# Altium project MODULIQ_ADC_40M_20B_2CH.PrjPcb (part 2 of 2)

## Sheet Power_Supply.SchDoc: Power Supply
size A3; Author: M.Beldyga; CompanyName: WUT ISE; DrawnBy: M.Beldyga; Organization: WUT ISE; Address1: PW ISE; Address2: Nowowiejska 15/19 00-665 Warsaw; Address3: micbeldyga@gmail.com; SheetNumber: 4; SheetTotal: 4; ModifiedBy: -; CheckedDate: -; Title2: MODULIQ; DivGrp: WUT ISE; Designer: M.Beldyga; ModifiedDate: -; ProjectName: Sensor Box
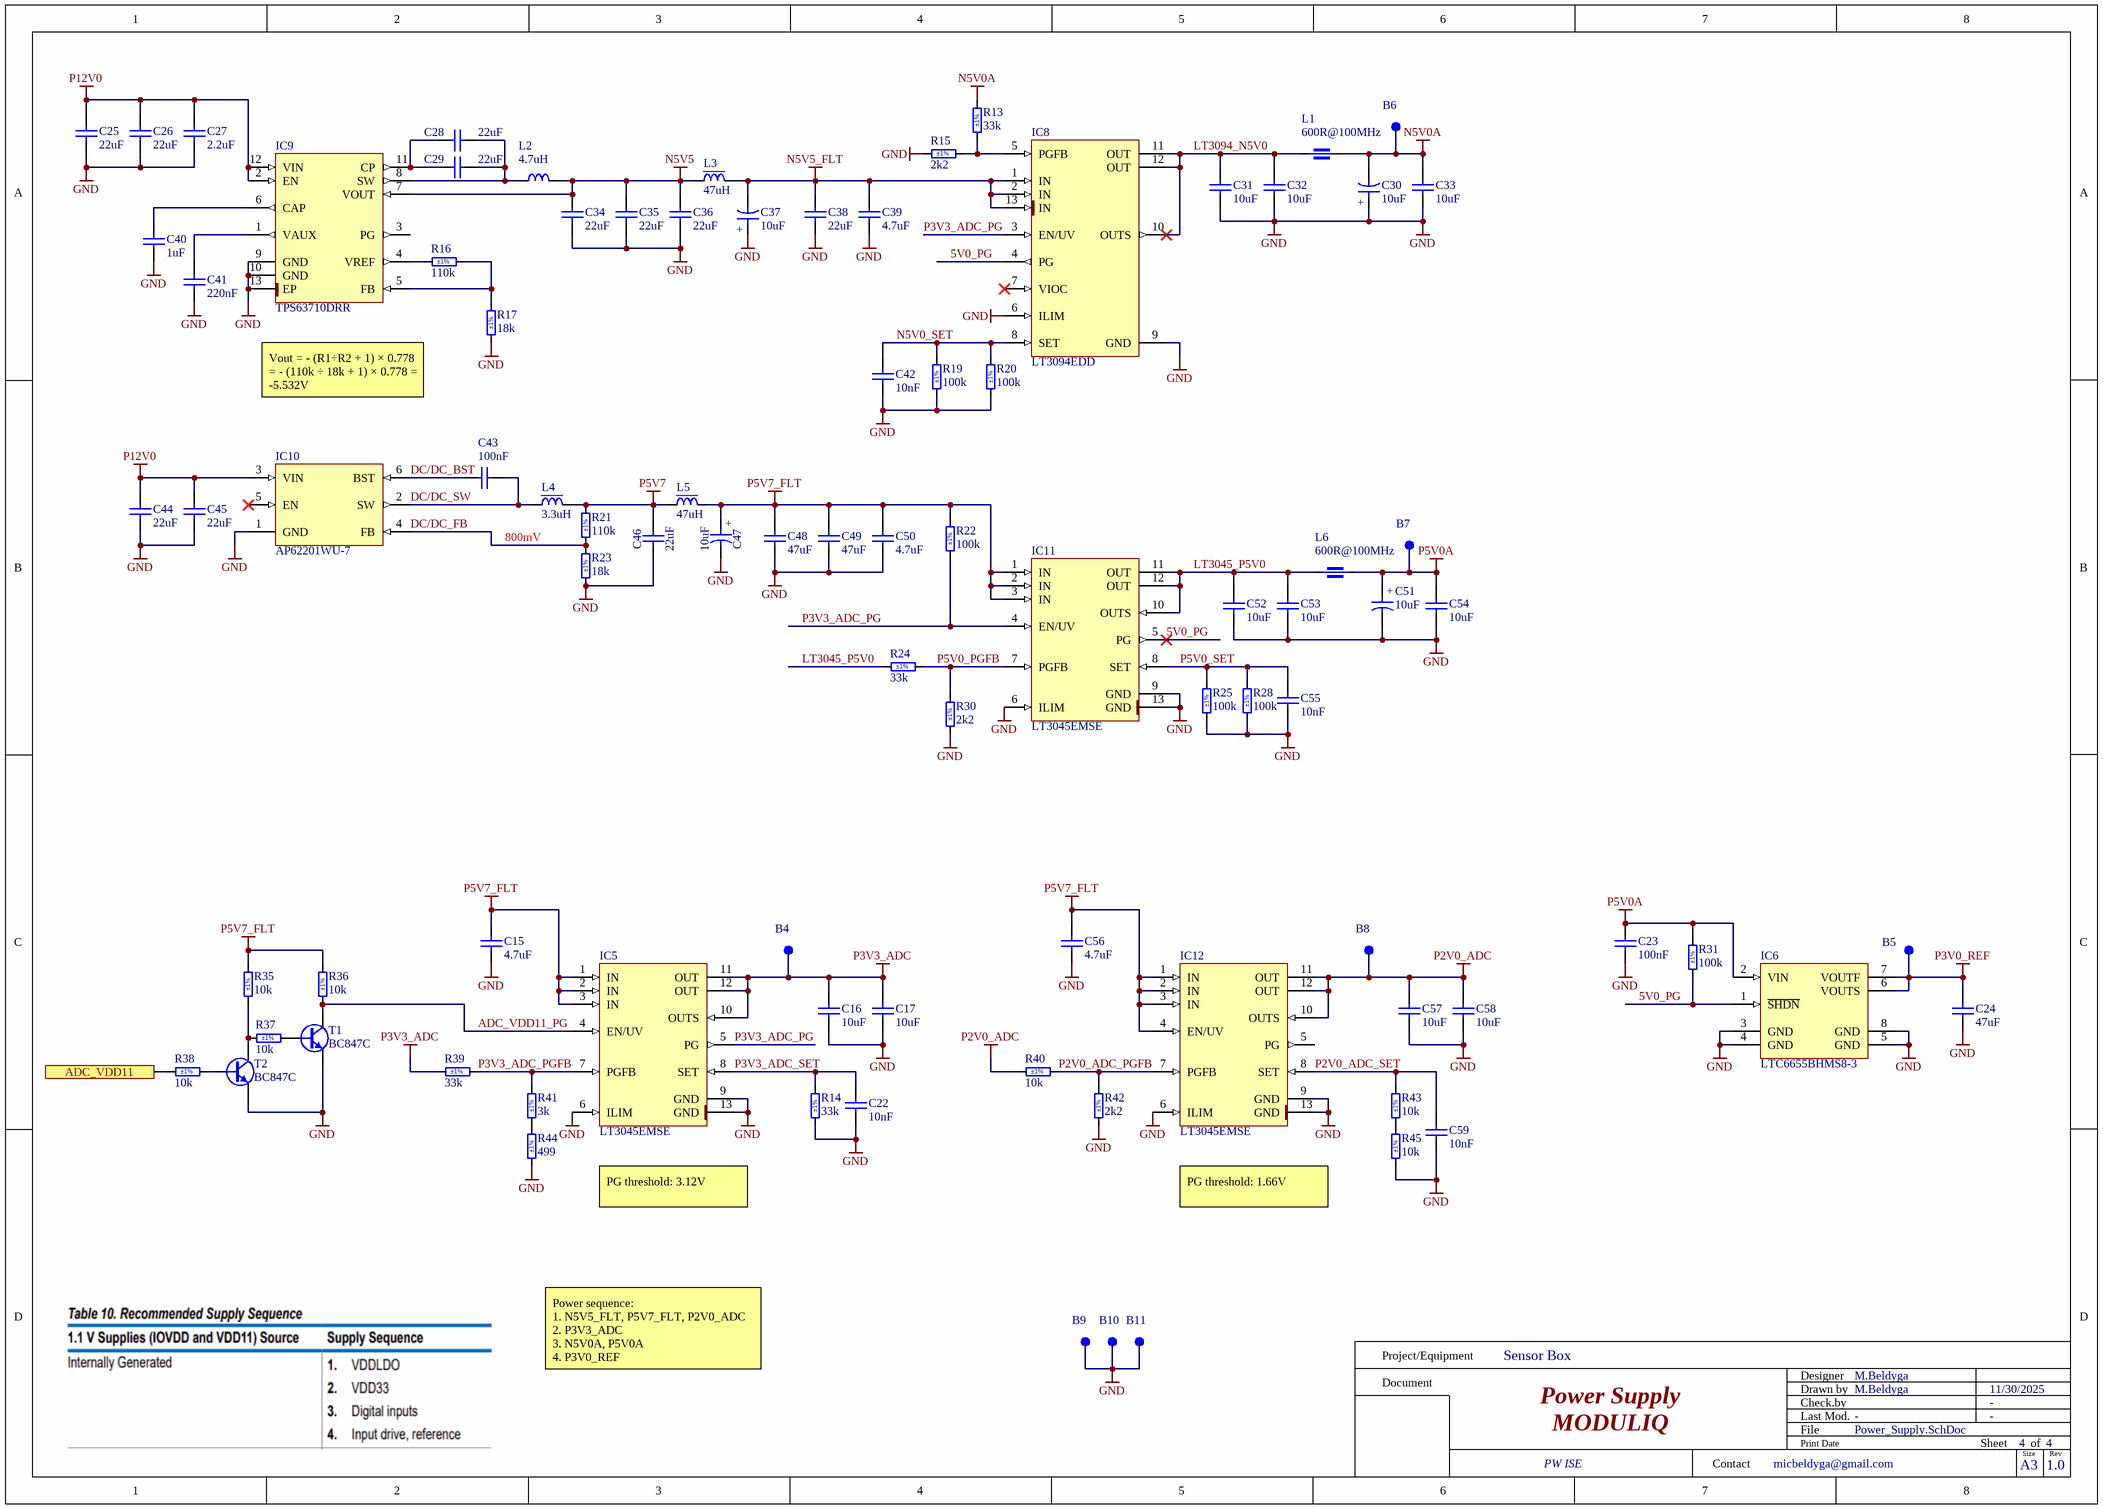
[diagram p3: Power_Supply.SchDoc]

### Parts
B4  SMD Pad  [C100]  (value not drawn)  (no BOM)
B5  SMD Pad  [C100]  (value not drawn)  (no BOM)
B6  SMD Pad  [C100]  (value not drawn)  (no BOM)
B7  SMD Pad  [C100]  (value not drawn)  (no BOM)
B8  SMD Pad  [C100]  (value not drawn)  (no BOM)
B9  SMD Pad  [C100]  (value not drawn)  (no BOM)
B10  SMD Pad  [C100]  (value not drawn)  (no BOM)
B11  SMD Pad  [C100]  (value not drawn)  (no BOM)
C15  4.7uF  [CAPC1608X90N]
C16  10uF  [CAPC2012X95N]
C17  10uF  [CAPC2012X95N]
C22  10nF  [CAPC1005X55N]
C23  100nF  [CAPC1005X55N]
C24  47uF  [CAPC2012X140N]
C25  22uF  [CAPC2012X135N]
C26  22uF  [CAPC2012X135N]
C27  2.2uF  [CAPC1005X55N]
C28  22uF  [CAPC2012X135N]
C29  22uF  [CAPC2012X135N]
C30  10uF  [CAPMP3216X180N]
C31  10uF  [CAPC2012X95N]
C32  10uF  [CAPC2012X95N]
C33  10uF  [CAPC2012X95N]
C34  22uF  [CAPC2012X135N]
C35  22uF  [CAPC2012X135N]
C36  22uF  [CAPC2012X135N]
C37  10uF  [CAPMP3216X180N]
C38  22uF  [CAPC2012X135N]
C39  4.7uF  [CAPC1608X90N]
C40  1uF  [CAPC1005X55N]
C41  220nF  [CAPC1005X55N]
C42  10nF  [CAPC1005X55N]
C43  100nF  [CAPC1005X55N]
C44  22uF  [CAPC2012X135N]
C45  22uF  [CAPC2012X135N]
C46  22uF  [CAPC2012X135N]
C47  10uF  [CAPMP3216X180N]
C48  47uF  [CAPC3216X180N]
C49  47uF  [CAPC3216X180N]
C50  4.7uF  [CAPC1608X90N]
C51  10uF  [CAPMP3216X180N]
C52  10uF  [CAPC2012X95N]
C53  10uF  [CAPC2012X95N]
C54  10uF  [CAPC2012X95N]
C55  10nF  [CAPC1005X55N]
C56  4.7uF  [CAPC1608X90N]
C57  10uF  [CAPC2012X95N]
C58  10uF  [CAPC2012X95N]
C59  10nF  [CAPC1005X55N]
IC5  LT3045EMSE  [SOP65P490X110-13N-R175X294]
IC6  LTC6655BHMS8-3  [SOP65P490X110-8N]
IC8  LT3094EDD  [SON45P300X300X80-13N-R175X248]
IC9  TPS63710DRR  [SON50P300X300X80-13N-R160X260]
IC10  AP62201WU-7  [SOT95P280X100-6N]
IC11  LT3045EMSE  [SOP65P490X110-13N-R175X294]
IC12  LT3045EMSE  [SOP65P490X110-13N-R175X294]
L1  600R@100MHz  [INDC1608X95N]
L2  4.7uH  [IND_COILCRAFT_EPL3015]
L3  47uH  [IND_WURTH_WE-LHMI_7050]
L4  3.3uH  [IND_COILCRAFT_SD43]
L5  47uH  [IND_WURTH_WE-LHMI_7050]
L6  600R@100MHz  [INDC1608X95N]
R13  33k  Tolerance: ±1%  [RESC1005X40N]
R14  33k  Tolerance: ±1%  [RESC1005X40N]
R15  2k2  Tolerance: ±1%  [RESC1005X40N]
R16  110k  Tolerance: ±1%  [RESC1005X40N]
R17  18k  Tolerance: ±1%  [RESC1005X40N]
R19  100k  Tolerance: ±1%  [RESC1005X40N]
R20  100k  Tolerance: ±1%  [RESC1005X40N]
R21  110k  Tolerance: ±1%  [RESC1005X40N]
R22  100k  Tolerance: ±1%  [RESC1005X40N]
R23  18k  Tolerance: ±1%  [RESC1005X40N]
R24  33k  Tolerance: ±1%  [RESC1005X40N]
R25  100k  Tolerance: ±1%  [RESC1005X40N]
R28  100k  Tolerance: ±1%  [RESC1005X40N]
R30  2k2  Tolerance: ±1%  [RESC1005X40N]
R31  100k  Tolerance: ±1%  [RESC1005X40N]
R35  10k  Tolerance: ±1%  [RESC1005X40N]
R36  10k  Tolerance: ±1%  [RESC1005X40N]
R37  10k  Tolerance: ±1%  [RESC1005X40N]
R38  10k  Tolerance: ±1%  [RESC1005X40N]
R39  33k  Tolerance: ±1%  [RESC1005X40N]
R40  10k  Tolerance: ±1%  [RESC1005X40N]
R41  3k  Tolerance: ±1%  [RESC1005X40N]
R42  2k2  Tolerance: ±1%  [RESC1005X40N]
R43  10k  Tolerance: ±1%  [RESC1005X40N]
R44  499  Tolerance: ±1%  [RESC1005X40N]
R45  10k  Tolerance: ±1%  [RESC1005X40N]
T1  BC847C  [SOT95P240X110-3N]
T2  BC847C  [SOT95P240X110-3N]

### Ports
ADC_VDD11

### Nets
GND: B9.1 B10.1 B11.1 C15.1 C16.1 C17.1 C22.1 C23.1 C24.1 C25.1 C26.1 C27.1 C30.1 C31.1 C32.1 C33.1 C34.1 C35.1 C36.1 C37.1 C38.1 C39.1 C40.1 C41.1 C42.1 C44.1 C45.1 C46.1 C47.2 C48.1 C49.1 C50.1 C51.2 C52.1 C53.1 C54.1 C55.1 C56.1 C57.1 C58.1 C59.1 IC5.6(ILIM) IC5.9(GND) IC5.13(GND) IC6.3(GND) IC6.4(GND) IC6.5(GND) IC6.8(GND) IC8.6(ILIM) IC8.9(GND) IC9.9(GND) IC9.10(GND) IC9.13(EP) IC10.1(GND) IC11.6(ILIM) IC11.9(GND) IC11.13(GND) IC12.6(ILIM) IC12.9(GND) IC12.13(GND) R14.1 R15.2 R17.1 R19.1 R20.1 R23.1 R25.1 R28.1 R30.1 R42.2 R44.1 R45.1 T1.2(E) T2.2(E)
N5V0A: B6.1 C30.2 C33.2 L1.2 R13.2
N5V5: C34.2 C35.2 C36.2 IC9.7(VOUT) L2.2 L3.1
N5V5_FLT: C37.2 C38.2 C39.2 IC8.1(IN) IC8.2(IN) IC8.13(IN) L3.2
P2V0_ADC: B8.1 C57.2 C58.2 IC12.10(OUTS) IC12.11(OUT) IC12.12(OUT) R40.2
P3V0_REF: B5.1 C24.2 IC6.6(VOUTS) IC6.7(VOUTF)
P3V3_ADC: B4.1 C16.2 C17.2 IC5.10(OUTS) IC5.11(OUT) IC5.12(OUT) R39.2
P5V0A: B7.1 C23.2 C51.1 C54.2 IC6.2(VIN) L6.2 R31.2
P5V7: C46.2 L4.2 L5.1 R21.2
P5V7_FLT: C15.2 C47.1 C48.2 C49.2 C50.2 C56.2 IC5.1(IN) IC5.2(IN) IC5.3(IN) IC11.1(IN) IC11.2(IN) IC11.3(IN) IC12.1(IN) IC12.2(IN) IC12.3(IN) IC12.4(EN/UV) L5.2 R22.2 R35.1 R36.1
P12V0: C25.2 C26.2 C27.2 C44.2 C45.2 IC9.2(EN) IC9.12(VIN) IC10.3(VIN)
5V0_PG: IC6.1(~{SHDN}) IC8.4(PG) IC11.5(PG) R31.1
ADC_VDD11_PG: IC5.4(EN/UV) R36.2 T1.3(C)
DC/DC_BST: C43.1 IC10.6(BST)
DC/DC_FB: IC10.4(FB) R21.1 R23.2
DC/DC_SW: C43.2 IC10.2(SW) L4.1
LT3045_P5V0: C52.2 C53.2 IC11.10(OUTS) IC11.11(OUT) IC11.12(OUT) L6.1 R24.2
LT3094_N5V0: C31.2 C32.2 IC8.10(OUTS) IC8.11(OUT) IC8.12(OUT) L1.1
N5V0_SET: C42.2 IC8.8(SET) R19.2 R20.2
P2V0_ADC_PGFB: IC12.7(PGFB) R40.1 R42.1
P2V0_ADC_SET: C59.2 IC12.8(SET) R43.2
P3V3_ADC_PG: IC5.5(PG) IC8.3(EN/UV) IC11.4(EN/UV) R22.1
P3V3_ADC_PGFB: IC5.7(PGFB) R39.1 R41.2
P3V3_ADC_SET: C22.2 IC5.8(SET) R14.2
P5V0_PGFB: IC11.7(PGFB) R24.1 R30.2
P5V0_SET: C55.2 IC11.8(SET) R25.2 R28.2
VDD11: R38.2 ; port ADC_VDD11
NetC28_1: C28.1 C29.1 IC9.8(SW) L2.1
NetC28_2: C28.2 C29.2 IC9.11(CP)
NetC40_2: C40.2 IC9.6(CAP)
NetC41_2: C41.2 IC9.1(VAUX)
NetIC8_5: IC8.5(PGFB) R13.1 R15.1
NetIC9_4: IC9.4(VREF) R16.1
NetIC9_5: IC9.5(FB) R16.2 R17.2
NetR35_2: R35.2 R37.2 T2.3(C)
NetR37_1: R37.1 T1.1(B)
NetR38_1: R38.1 T2.1(B)
NetR41_1: R41.1 R44.2
NetR43_1: R43.1 R45.2

Not connected (* = marked no-connect by the designer): IC8 7(VIOC)*; IC9 3(PG); IC10 5(EN)*; IC12 5(PG)

### Notes on the sheet
- Vout = - (R1÷R2 + 1) × 0.778 = - (110k ÷ 18k + 1) × 0.778 = -5.532V
- (near L4) 800mV
- PG threshold: 3.12V
- PG threshold: 1.66V
- Power sequence:
  1. N5V5_FLT, P5V7_FLT, P2V0_ADC
  2. P3V3_ADC
  3. N5V0A, P5V0A
  4. P3V0_REF
- Project/Equipment
- Document
- Designer
- Drawn by
- Check.by
- Contact
- File
- Last Mod.
- Print Date
- Sheet
- Size
- A3
- of
- Rev
- (in symbol CTE3216-18_10UF_10V_10%_LESR1800) +
- (in symbol CTE3216-18_10UF_16V_20%_AVX_TCJ) +

### Library data of the parts
B4-B11 = SMD_PAD_D1MM: Pad; Part Description: 1mm Diameter SMD Pad; Mounted: No; Part Number: SMD_PAD_D1MM; Component Type: Standard (No BOM); Pin Count: 1; Family: SMD Pad; Socket: No; SMD: Yes; Sense: No; Status: None; ComponentHeight: 0mm; HelpURL: Undefined; Author: CERN DEM JLC; CreateDate: 10/10/2017; LatestRevisionDate: 10/10/2017; PackageDescription: 1mm Diameter SMD Pad
C15 C39 C50 C56 = CC0603_4.7UF_25V_10%_X5R: Non-polarised capacitor; Part Description: SMD Multilayer Chip Ceramic Capacitor; Manufacturer: GENERIC; Manufacturer1 Part Number: GRM188R61E475KE11D; Voltage: 25V; TC: X5R; Tolerance: ±10%; Part Number: CC0603_4.7UF_25V_10%_X5R; Component Kind: Standard; Component Type: Standard; Pin Count: 2; Value: 4.7uF; Status: None; Manufacturer Part Number: CC0603_4.7UF_25V_10%_X5R; Case: 0603; Mounted: Yes; Socket: No; SMD: Yes; Sense: No; Manufacturer1 Example: MURATA; Manufacturer1 ComponentHeight: 0.95mm; HelpURL: \\cern.ch\dfs\Applications\Altium\Datasheets\CC0603_MURATA_GRM188R61E475KE11D.pdf; Author: CERN DEM JLC; CreateDate: 11/10/2014; LatestRevisionDate: 11/10/2014
C16 C17 C31-C33 C52-C54 C57 C58 = CC0805_10UF_25V_10%_X5R: Non-polarised capacitor; Part Description: SMD Multilayer Chip Ceramic Capacitor; Manufacturer: GENERIC; Manufacturer1 Part Number: GRM219R61E106KA12D; Voltage: 25V; TC: X5R; Tolerance: ±10%; Part Number: CC0805_10UF_25V_10%_X5R; Component Kind: Standard; Component Type: Standard; Pin Count: 2; Value: 10uF; Status: Preferred; Manufacturer Part Number: CC0805_10UF_25V_10%_X5R; Case: 0805; Mounted: Yes; Socket: No; SMD: Yes; Sense: No; Manufacturer1 Example: MURATA; Manufacturer1 ComponentHeight: 0.95mm; HelpURL: \\cern.ch\dfs\Applications\Altium\Datasheets\CC0805_X5R_MURATA_GRM.pdf; Author: CERN DEM JLC; CreateDate: 10/25/2012; LatestRevisionDate: 9/6/2016
C22 C42 C55 C59 = CC0402_10NF_16V_10%_X7R: Non-polarised capacitor; Part Description: SMD Multilayer Chip Ceramic Capacitor; Manufacturer: GENERIC; Manufacturer1 Part Number: 223878715636; Voltage: 16V; TC: X7R; Tolerance: ±10%; Part Number: CC0402_10NF_16V_10%_X7R; Component Kind: Standard; Component Type: Standard; Pin Count: 2; Value: 10nF; Status: Not Recommended; Manufacturer Part Number: CC0402_10NF_16V_10%_X7R; Case: 0402; Mounted: Yes; Socket: No; SMD: Yes; Sense: No; Manufacturer1 Example: PHYCOMP; Manufacturer1 ComponentHeight: 0.55mm; HelpURL: \\cern.ch\dfs\Applications\Altium\Datasheets\CC0402_X7R_PHYCOMP.pdf; Author: CERN DEM JLC; CreateDate: 12/3/2007; LatestRevisionDate: 12/3/2007
C23 = CC0402_100NF_50V_10%_X7R: Non-polarised capacitor; Part Description: SMD Multilayer Chip Ceramic Capacitor; Manufacturer: GENERIC; Manufacturer1 Part Number: GRM155R71H104KE14D; Voltage: 50V; TC: X7R; Tolerance: ±10%; Part Number: CC0402_100NF_50V_10%_X7R; Component Kind: Standard; Component Type: Standard; Pin Count: 2; Value: 100nF; Status: None; Manufacturer Part Number: CC0402_100NF_50V_10%_X7R; Case: 0402; Mounted: Yes; Socket: No; SMD: Yes; Sense: No; Manufacturer1 Example: MURATA; Manufacturer1 ComponentHeight: 0.55mm; HelpURL: \\cern.ch\dfs\Applications\Altium\Datasheets\CC0402_MURATA_GRM155R71H104KE14D.pdf; Author: CERN DEM MR; CreateDate: 6/30/2017; LatestRevisionDate: 6/30/2017
C24 = CC0805_47UF_6.3V_10%_X5R: Non-polarised capacitor; Part Description: SMD Multilayer Chip Ceramic Capacitor; Manufacturer: GENERIC; Manufacturer1 Part Number: C0805C476K9PAC; Voltage: 6.3V; TC: X5R; Tolerance: ±10%; Part Number: CC0805_47UF_6.3V_10%_X5R; Component Kind: Standard; Component Type: Standard; Pin Count: 2; Value: 47uF; Status: Preferred; Manufacturer Part Number: CC0805_47UF_6.3V_10%_X5R; Case: 0805; Mounted: Yes; Socket: No; SMD: Yes; Sense: No; Manufacturer1 Example: KEMET; Manufacturer1 ComponentHeight: 1.4mm; HelpURL: \\cern.ch\dfs\Applications\Altium\Datasheets\CC0805_X5R_KEMET.pdf; Author: CERN DEM HF; CreateDate: 7/10/2023; LatestRevisionDate: 7/10/2023
C25 C26 C28 C29 C34-C36 C38 C44-C46 = CC0805_22UF_16V_10%_X5R: Non-polarised capacitor; Part Description: SMD Multilayer Chip Ceramic Capacitor; Manufacturer: GENERIC; Manufacturer1 Part Number: C2012X5R1C226KT; Voltage: 16V; TC: X5R; Tolerance: ±10%; Part Number: CC0805_22UF_16V_10%_X5R; Component Kind: Standard; Component Type: Standard; Pin Count: 2; Value: 22uF; Status: Preferred; Manufacturer Part Number: CC0805_22UF_16V_10%_X5R; Case: 0805; Mounted: Yes; Socket: No; SMD: Yes; Sense: No; Manufacturer1 Example: TDK; Manufacturer1 ComponentHeight: 1.35mm; HelpURL: \\cern.ch\dfs\Applications\Altium\Datasheets\CC0805_X5R_TDK_C.pdf; Author: CERN DEM JLC
  C25 C26 C28 C29 C34-C36 C44 C45: CreateDate: 10/25/2012; LatestRevisionDate: 10/25/2012
  C38 C46: CreateDate: 25.10.2012; LatestRevisionDate: 25.10.2012
C27 = CC0402_2.2UF_25V_10%_X5R: Non-polarised capacitor; Part Description: SMD Multilayer Chip Ceramic Capacitor; Manufacturer: GENERIC; Manufacturer1 Part Number: C1005X5R1E225K050; Voltage: 25V; TC: X5R; Tolerance: ±10%; Part Number: CC0402_2.2UF_25V_10%_X5R; Component Kind: Standard; Component Type: Standard; Pin Count: 2; Value: 2.2uF; Status: None; Manufacturer Part Number: CC0402_2.2UF_25V_10%_X5R; Case: 0402; Mounted: Yes; Socket: No; SMD: Yes; Sense: No; Manufacturer1 Example: TDK; Manufacturer1 ComponentHeight: 0.65mm; HelpURL: \\cern.ch\dfs\Applications\Altium\Datasheets\CC0402_X5R_TDK_C.pdf; Author: CERN DEM BC; CreateDate: 1/10/2020; LatestRevisionDate: 1/10/2020
C30 C51 = CTE3216-18_10UF_10V_10%_LESR1800: Polarised capacitor; Part Description: Low ESR 1R8 Solid Tantalum Chip Capacitor; Manufacturer: GENERIC; Manufacturer1 Part Number: TPSA106K010R1800; Voltage: 10V; Tolerance: ±10%; Part Number: CTE3216-18_10UF_10V_10%_LESR1800; Component Kind: Standard; Component Type: Standard; Pin Count: 2; Value: 10uF; Status: Preferred; Manufacturer Part Number: CTE3216-18_10UF_10V_10%_LESR1800; Case: A; Mounted: Yes; Socket: No; SMD: Yes; Sense: No; Manufacturer1 Example: AVX; Manufacturer1 ComponentHeight: 1.8mm; HelpURL: \\cern.ch\dfs\Applications\Altium\Datasheets\CTE-LESR_AVX_TPS.pdf; Author: CERN DEM JLC; CreateDate: 5/5/2008; LatestRevisionDate: 1/20/2009
C37 C47 = CTE3216-18_10UF_16V_20%_AVX_TCJ: Polarised capacitor; Part Description: ESR 0R200 Tantalum Solid Electrolytic Chip Capacitor with Conductive Polymer Electrode; Manufacturer: AVX; Manufacturer Part Number: TCJA106M016R0200; Voltage: 16V; Tolerance: ±20%; Part Number: CTE3216-18_10UF_16V_20%_AVX_TCJ; Component Kind: Standard; Component Type: Standard; Pin Count: 2; Value: 10uF; Status: Preferred; Case: A; Mounted: Yes; Socket: No; SMD: Yes; Sense: No; ComponentHeight: 1.8mm; HelpURL: \\cern.ch\dfs\Applications\Altium\Datasheets\CTE_AVX_TCJ.pdf; Author: CERN DEM JLC; CreateDate: 29.03.2012; LatestRevisionDate: 29.03.2012
C40 = CC0402_1UF_16V_10%_X5R: Non-polarised capacitor; Part Description: SMD Multilayer Chip Ceramic Capacitor; Manufacturer: GENERIC; Manufacturer1 Part Number: C1005X5R1C105KT; Voltage: 16V; TC: X5R; Tolerance: ±10%; Part Number: CC0402_1UF_16V_10%_X5R; Component Kind: Standard; Component Type: Standard; Pin Count: 2; Value: 1uF; Status: Preferred; Manufacturer Part Number: CC0402_1UF_16V_10%_X5R; Case: 0402; Mounted: Yes; Socket: No; SMD: Yes; Sense: No; Manufacturer1 Example: TDK; Manufacturer1 ComponentHeight: 0.55mm; HelpURL: \\cern.ch\dfs\Applications\Altium\Datasheets\CC0402_X5R_TDK_C.pdf; Author: CERN DEM JLC; CreateDate: 10/25/2012; LatestRevisionDate: 10/25/2012
C41 = CC0402_220NF_25V_10%_X7R: Non-polarised capacitor; Part Description: SMD Multilayer Chip Ceramic Capacitor; Manufacturer: GENERIC; Manufacturer1 Part Number: C1005X7R1E224K050; Voltage: 25V; TC: X7R; Tolerance: ±10%; Part Number: CC0402_220NF_25V_10%_X7R; Component Kind: Standard; Component Type: Standard; Pin Count: 2; Value: 220nF; Status: Preferred; Manufacturer Part Number: CC0402_220NF_25V_10%_X7R; Case: 0402; Mounted: Yes; Socket: No; SMD: Yes; Sense: No; Manufacturer1 Example: TDK; Manufacturer1 ComponentHeight: 0.55mm; HelpURL: \\cern.ch\dfs\Applications\Altium\Datasheets\CC0402_X7R_TDK_C.pdf; Author: CERN DEM BC; CreateDate: 10/19/2020; LatestRevisionDate: 10/19/2020
C43 = CC0402_100NF_16V_10%_X7R: Non-polarised capacitor; Part Description: SMD Multilayer Chip Ceramic Capacitor; Manufacturer: GENERIC; Manufacturer1 Part Number: GRM155R71C104KA88D; Voltage: 16V; TC: X7R; Tolerance: ±10%; Part Number: CC0402_100NF_16V_10%_X7R; Component Kind: Standard; Component Type: Standard; Pin Count: 2; Value: 100nF; Status: Not Recommended; Manufacturer Part Number: CC0402_100NF_16V_10%_X7R; Case: 0402; Mounted: Yes; Socket: No; SMD: Yes; Sense: No; Manufacturer1 Example: MURATA; Manufacturer1 ComponentHeight: 0.55mm; HelpURL: \\cern.ch\dfs\Applications\Altium\Datasheets\CC0402_X7R_MURATA_GRM.pdf; Author: CERN DEM JLC; CreateDate: 12/5/2013; LatestRevisionDate: 12/3/2007
C48 C49 = CC1206_47UF_25V_20%_X5R: Non-polarised capacitor; Part Description: SMD Multilayer Chip Ceramic Capacitor; Manufacturer: GENERIC; Manufacturer1 Part Number: C3216X5R1E476M160; Voltage: 25V; TC: X5R; Tolerance: ±20%; Part Number: CC1206_47UF_25V_20%_X5R; Component Kind: Standard; Component Type: Standard; Pin Count: 2; Value: 47uF; Status: None; Manufacturer Part Number: CC1206_47UF_25V_20%_X5R; Case: 1206; Mounted: Yes; Socket: No; SMD: Yes; Sense: No; Manufacturer1 Example: TDK; Manufacturer1 ComponentHeight: 1.8mm; HelpURL: \\cern.ch\dfs\Applications\Altium\Datasheets\CC1206_X5R_TDK_C.pdf; Author: CERN DEM JLC; CreateDate: 11/20/2013; LatestRevisionDate: 3/14/2017
IC5 IC11 IC12 = LT3045EMSE: 20V, 500mA, Ultralow Noise, Ultrahigh PSRR Linear Regulator; Manufacturer: LINEAR TECHNOLOGY; PressFit: No; Bonding: No; Part Number: LT3045EMSE; Component Kind: Standard; Component Type: Standard; Device: LT3045EMSE; PackageDescription: SOP, 0.65mm Pitch; 12 Pin, 3.00mm W X 4.039mm L X 1.10mm H body (w/Thermal Tab 1.75 X 2.94 mm), IPC Medium Density; Part Description: 20V, 500mA, Ultralow Noise, Ultrahigh PSRR Linear Regulator; Manufacturer Part Number: LT3045EMSE; Pin Count: 13; Case: MSOP12; Mounted: Yes; Socket: No; SMD: Yes; Sense: No; ComponentHeight: 1.1mm; HelpURL: \\cern.ch\dfs\Applications\Altium\Datasheets\LT3045.pdf; Author: CERN DEM HF; CreateDate: 5/18/2022; LatestRevisionDate: 5/18/2022
IC6 = LTC6655BHMS8-3: 0.25ppm Noise, Low Drift Precision Buffered Voltage Reference; Part Description: 3V, 0.25ppm Noise, Low Drift Precision Buffered Voltage Reference; Manufacturer: ANALOG DEVICES; PressFit: No; Bonding: No; Part Number: LTC6655BHMS8-3; Component Kind: Standard; Component Type: Standard; Device: LTC6655BHMS8-3; PackageDescription: SOP, 8-Leads, Body 3.1x3.1mm (max), Pitch 0.65mm, IPC Medium Density; Manufacturer Part Number: LTC6655BHMS8-3; Pin Count: 8; Case: SSOP8; Mounted: Yes; Socket: No; SMD: Yes; Sense: No; ComponentHeight: 1.1mm; HelpURL: \\cern.ch\dfs\Applications\Altium\Datasheets\LTC6655BHMS8-3.pdf; Author: CERN DEM HF; CreateDate: 12/13/2021; LatestRevisionDate: 12/13/2021
IC8 = LT3094EDD#PBF: -20V, 500mA, Ultralow Noise, Ultrahigh PSRR Negative Linear Regulator; Manufacturer: LINEAR TECHNOLOGY; PressFit: No; Bonding: No; Part Number: LT3094EDD#PBF; Component Kind: Standard; Component Type: Standard; Device: LT3094EDD; PackageDescription: SON, 0.45mm Pitch; 12 Pin, 3.00mm W X 3.00mm L X 0.80mm H body (w/Thermal Tab 1.75 X 2.48mm), IPC Medium Density; Part Description: -20V, 500mA, Ultralow Noise, Ultrahigh PSRR Negative Linear Regulator; Manufacturer Part Number: LT3094EDD; Pin Count: 13; Case: SON12; Mounted: Yes; Socket: No; SMD: Yes; Sense: No; ComponentHeight: 0.8mm; HelpURL: \\cern.ch\dfs\Applications\Altium\Datasheets\LT3094EDD#PBF.pdf; Author: CERN DEM JLC; CreateDate: 11/12/2018; LatestRevisionDate: 2/3/2022
IC9 = TPS63710DRR: -1 to -5.5VDC, 1A Output, Low Noise Synchronous Inverting Buck Converter; Manufacturer: TEXAS INSTRUMENTS; PressFit: No; Bonding: No; Part Number: TPS63710DRR; Component Kind: Standard; Component Type: Standard; Device: TPS63710DRR; PackageDescription: SON, 0.50mm Pitch; 12 Pin, 3.00mm W X 3.00mm L X 0.80mm H body (w/Thermal Tab 1.60 X 2.60mm), IPC Medium Density; Part Description: -1 to -5.5VDC, 1A Output, Low Noise Synchronous Inverting Buck Converter; Manufacturer Part Number: TPS63710DRR; Pin Count: 13; Case: SON12; Mounted: Yes; Socket: No; SMD: Yes; Sense: No; ComponentHeight: 0.8mm; HelpURL: \\cern.ch\dfs\Applications\Altium\Datasheets\TPS63710DRR.pdf; Author: CERN DEM BC; CreateDate: 2/11/2019; LatestRevisionDate: 2/11/2019
IC10 = AP62201WU-7: 4.2V TO 18V INPUT, 2A LOW IQ SYNCHRONOUS BUCK CONVERTER; Manufacturer: DIODES INCORPORATED; PressFit: No; Bonding: No; Part Number: AP62201WU-7; Component Kind: Standard; Component Type: Standard; Device: AP62201WU-7; PackageDescription: SOT23, 0.95mm Pitch; 6 Pin, 1.625mm W X 2.90mm L X 1.00mm H body, IPC Medium Density; Part Description: 4.2V To 18V Input, 2A Low Iq Synchronous Buck Converter; Manufacturer Part Number: AP62201WU; Pin Count: 6; Case: SOT23-6; Mounted: Yes; Socket: No; SMD: Yes; Sense: No; ComponentHeight: 1.1mm; HelpURL: \\cern.ch\dfs\Applications\Altium\Datasheets\AP6220x.pdf; Author: CERN DEM HF; CreateDate: 1/7/2022; LatestRevisionDate: 3/21/2022
L1 L6 = IND0603_MURATA_BLM18BD601SN1D: Part Description: SMD EMIFIL Suppression Chip Ferrite Bead; Manufacturer: MURATA; Power: 200mA; Resistance: 0.65R; Tolerance: ±25%; Part Number: IND0603_MURATA_BLM18BD601SN1D; Component Kind: Standard; Component Type: Standard; Pin Count: 2; Value: 600R@100MHz; Manufacturer Part Number: BLM18BD601SN1D; Case: 0603; Mounted: Yes; Socket: No; SMD: Yes; Sense: No; ComponentHeight: 0.95mm; HelpURL: \\cern.ch\dfs\Applications\Altium\Datasheets\IND0603_MURATA_BLM18B.pdf; Author: CERN DEM JLC; CreateDate: 7/4/2012; LatestRevisionDate: 10/25/2018
L2 = IND_4.7UH_20%_COILCRAFT_EPL3015: Inductor; Part Description: Shielded SMD Power Inductor; Manufacturer Part Number: EPL3015-472ML; Power: 1A; Resistance: 0.145R; Tolerance: ±20%; Part Number: IND_4.7UH_20%_COILCRAFT_EPL3015; Component Kind: Standard; Component Type: Standard; Pin Count: 2; Value: 4.7uH; Manufacturer: COILCRAFT; Mounted: Yes; Socket: No; SMD: Yes; Sense: No; ComponentHeight: 1.55mm; HelpURL: \\cern.ch\dfs\Applications\Altium\Datasheets\IND_COILCRAFT_EPL3015.pdf; Author: CERN DEM BC; CreateDate: 2/27/2017; LatestRevisionDate: 2/27/2017
L3 L5 = IND_47UH_20%_WURTH_WE-LHMI_74437349470: Inductor With Core; Part Description: SMD Power Inductor (WE-LHMI Series); Manufacturer: WURTH ELEKTRONIK; Power: 1.45A; Resistance: 0.290R; Tolerance: ±20%; Part Number: IND_47UH_20%_WURTH_WE-LHMI_74437349470; Component Kind: Standard; Component Type: Standard; Pin Count: 2; Value: 47uH; Manufacturer Part Number: 74437349470; Mounted: Yes; Socket: No; SMD: Yes; Sense: No; ComponentHeight: 5mm; HelpURL: \\cern.ch\dfs\Applications\Altium\Datasheets\IND_WURTH_WE-LHMI_74437349470.pdf; Author: CERN DEM HF; CreateDate: 11/22/2023; LatestRevisionDate: 11/22/2023
L4 = IND_3.3UH_20%_COILCRAFT_SD43-332MLB: Inductor With Core; Part Description: SMT Power Inductor (SD43 Series); Power: 2.1A; Resistance: 0.582R; Tolerance: ±20%; Part Number: IND_3.3UH_20%_COILCRAFT_SD43-332MLB; Component Kind: Standard; Component Type: Standard; Pin Count: 2; Value: 3.3uH; Manufacturer: COILCRAFT; Manufacturer Part Number: SD43-332MLB; Mounted: Yes; Socket: No; SMD: Yes; Sense: No; ComponentHeight: 3.45mm; HelpURL: \\cern.ch\dfs\Applications\Altium\Datasheets\IND_COILCRAFT_SD43.pdf; Author: CERN DEM JLC; CreateDate: 9/13/2018; LatestRevisionDate: 9/13/2018
R13 R14 R24 R39 = R0402_33K_1%_0.0625W_100PPM: Resistor - 1%; Part Description: General Purpose Thick Film Chip Resistor; Manufacturer: GENERIC; Manufacturer1 Part Number: 232270673303L; TC: ±100ppm/°C; PressFit: No; Part Number: R0402_33K_1%_0.0625W_100PPM; Component Kind: Standard; Component Type: Standard; Pin Count: 2; Value: 33k; Status: Not Recommended; Power: 0.0625W; Manufacturer Part Number: R0402_33K_1%_0.0625W_100PPM; Case: 0402; Mounted: Yes; Sense: No; Socket: No; SMD: Yes; Manufacturer1 Example: YAGEO PHYCOMP; Manufacturer1 ComponentHeight: 0.4mm; HelpURL: \\cern.ch\dfs\Applications\Altium\Datasheets\R0402_Phycomp_RC0402.pdf; Author: CERN DEM JLC; CreateDate: 12/3/2007; LatestRevisionDate: 10/17/2012
R15 R30 R42 = R0402_2K2_1%_0.0625W_100PPM: Resistor - 1%; Part Description: General Purpose Thick Film Chip Resistor; Manufacturer: GENERIC; Manufacturer1 Part Number: 232270672202L; TC: ±100ppm/°C; PressFit: No; Part Number: R0402_2K2_1%_0.0625W_100PPM; Component Kind: Standard; Component Type: Standard; Pin Count: 2; Value: 2k2; Status: Not Recommended; Power: 0.0625W; Manufacturer Part Number: R0402_2K2_1%_0.0625W_100PPM; Case: 0402; Mounted: Yes; Sense: No; Socket: No; SMD: Yes; Manufacturer1 Example: YAGEO PHYCOMP; Manufacturer1 ComponentHeight: 0.4mm; HelpURL: \\cern.ch\dfs\Applications\Altium\Datasheets\R0402_Phycomp_RC0402.pdf; Author: CERN DEM JLC; CreateDate: 12/3/2007; LatestRevisionDate: 10/17/2012
R16 R21 = R0402_110K_1%_0.0625W_100PPM: Resistor - 1%; Part Description: General Purpose Thick Film Chip Resistor; Manufacturer: GENERIC; Manufacturer1 Part Number: 232270671104L; TC: ±100ppm/°C; PressFit: No; Part Number: R0402_110K_1%_0.0625W_100PPM; Component Kind: Standard; Component Type: Standard; Pin Count: 2; Value: 110k; Status: Not Recommended; Power: 0.0625W; Manufacturer Part Number: R0402_110K_1%_0.0625W_100PPM; Case: 0402; Mounted: Yes; Sense: No; Socket: No; SMD: Yes; Manufacturer1 Example: YAGEO PHYCOMP; Manufacturer1 ComponentHeight: 0.4mm; HelpURL: \\cern.ch\dfs\Applications\Altium\Datasheets\R0402_Phycomp_RC0402.pdf; Author: CERN DEM JLC; CreateDate: 12/3/2007; LatestRevisionDate: 10/17/2012
R17 R23 = R0402_18K_1%_0.0625W_100PPM: Resistor - 1%; Part Description: General Purpose Thick Film Chip Resistor; Manufacturer: GENERIC; Manufacturer1 Part Number: 232270671803L; TC: ±100ppm/°C; PressFit: No; Part Number: R0402_18K_1%_0.0625W_100PPM; Component Kind: Standard; Component Type: Standard; Pin Count: 2; Value: 18k; Status: Not Recommended; Power: 0.0625W; Manufacturer Part Number: R0402_18K_1%_0.0625W_100PPM; Case: 0402; Mounted: Yes; Sense: No; Socket: No; SMD: Yes; Manufacturer1 Example: YAGEO PHYCOMP; Manufacturer1 ComponentHeight: 0.4mm; HelpURL: \\cern.ch\dfs\Applications\Altium\Datasheets\R0402_Phycomp_RC0402.pdf; Author: CERN DEM JLC; CreateDate: 12/3/2007; LatestRevisionDate: 10/17/2012
R19 R20 R22 R25 R28 R31 = R0402_100K_1%_0.0625W_100PPM: Resistor - 1%; Part Description: General Purpose Thick Film Chip Resistor; Manufacturer: GENERIC; Manufacturer1 Part Number: 232270671004L; TC: ±100ppm/°C; PressFit: No; Part Number: R0402_100K_1%_0.0625W_100PPM; Component Kind: Standard; Component Type: Standard; Pin Count: 2; Value: 100k; Status: Not Recommended; Power: 0.0625W; Manufacturer Part Number: R0402_100K_1%_0.0625W_100PPM; Case: 0402; Mounted: Yes; Sense: No; Socket: No; SMD: Yes; Manufacturer1 Example: YAGEO PHYCOMP; Manufacturer1 ComponentHeight: 0.4mm; HelpURL: \\cern.ch\dfs\Applications\Altium\Datasheets\R0402_Phycomp_RC0402.pdf; Author: CERN DEM JLC; CreateDate: 12/3/2007; LatestRevisionDate: 10/17/2012
R35-R38 R40 R43 R45 = R0402_10K_1%_0.0625W_100PPM: Resistor - 1%; Part Description: General Purpose Thick Film Chip Resistor; Manufacturer: GENERIC; Manufacturer1 Part Number: 232270671003L; TC: ±100ppm/°C; PressFit: No; Part Number: R0402_10K_1%_0.0625W_100PPM; Component Kind: Standard; Component Type: Standard; Pin Count: 2; Value: 10k; Status: Not Recommended; Power: 0.0625W; Manufacturer Part Number: R0402_10K_1%_0.0625W_100PPM; Case: 0402; Mounted: Yes; Sense: No; Socket: No; SMD: Yes; Manufacturer1 Example: YAGEO PHYCOMP; Manufacturer1 ComponentHeight: 0.4mm; HelpURL: \\cern.ch\dfs\Applications\Altium\Datasheets\R0402_Phycomp_RC0402.pdf; Author: CERN DEM JLC; CreateDate: 12/3/2007; LatestRevisionDate: 10/17/2012
R41 = R0402_3K_1%_0.0625W_100PPM: Resistor - 1%; Part Description: General Purpose Thick Film Chip Resistor; Manufacturer: GENERIC; Manufacturer1 Part Number: 232270673002L; TC: ±100ppm/°C; PressFit: No; Part Number: R0402_3K_1%_0.0625W_100PPM; Component Kind: Standard; Component Type: Standard; Pin Count: 2; Value: 3k; Status: Not Recommended; Power: 0.0625W; Manufacturer Part Number: R0402_3K_1%_0.0625W_100PPM; Case: 0402; Mounted: Yes; Sense: No; Socket: No; SMD: Yes; Manufacturer1 Example: YAGEO PHYCOMP; Manufacturer1 ComponentHeight: 0.4mm; HelpURL: \\cern.ch\dfs\Applications\Altium\Datasheets\R0402_Phycomp_RC0402.pdf; Author: CERN DEM JLC; CreateDate: 12/3/2007; LatestRevisionDate: 10/17/2012
R44 = R0402_499R_1%_0.1W_100PPM: Resistor - 1%; Part Description: General Purpose Thick Film Chip Resistor; Manufacturer: GENERIC; Manufacturer1 Part Number: ERJ2RKF4990X; Power: 0.1W; TC: ±100ppm/°C; Voltage: 50V; PressFit: No; Part Number: R0402_499R_1%_0.1W_100PPM; Component Kind: Standard; Component Type: Standard; Pin Count: 2; Value: 499; Status: Not Recommended; Manufacturer Part Number: R0402_499R_1%_0.1W_100PPM; Case: 0402; Mounted: Yes; Sense: No; Socket: No; SMD: Yes; Manufacturer1 Example: PANASONIC; Manufacturer1 ComponentHeight: 0.4mm; HelpURL: \\cern.ch\dfs\Applications\Altium\Datasheets\R0402_PANASONIC_ERJ2RK.pdf; Author: CERN DEM MR; CreateDate: 11/22/2016; LatestRevisionDate: 11/22/2016
T1 T2 = BC847C: NPN Transistor; Part Description: 45V 100mA NPN Silicon AF Transistor; Manufacturer: INFINEON; PressFit: No; Bonding: No; Part Number: BC847C; Component Kind: Standard; Component Type: Standard; Device: BC847C; PackageDescription: SOT23, 0.95mm Pitch; 3 Pin, 1.40mm W X 3.00mm L X 1.10mm H body, IPC Medium Density; Manufacturer Part Number: BC847C; Pin Count: 3; Case: SOT23-3; Mounted: Yes; Socket: No; SMD: Yes; Sense: No; ComponentHeight: 1.1mm; HelpURL: \\cern.ch\dfs\Applications\Altium\Datasheets\BC847C.pdf; Author: CERN DEM JLC; CreateDate: 9/23/2014; LatestRevisionDate: 9/23/2014

## Nets that join several sheets
GND: MODULIQ_ADC_40M_20B_2CH (J1.2 J2.2 J3.2 J5.2), SPI_IFC (53 pins), U_ADC (28 pins), U_ADC (28 pins), Power_Supply (74 pins)
N5V0A: MODULIQ_ADC_40M_20B_2CH (D1.1 D2.1 D3.1 D4.1), U_ADC (C13A.2 IC2A.14 IC2A.15 IC2A.17), U_ADC (C13B.2 IC2B.14 IC2B.15 IC2B.17), Power_Supply (5 pins)
P2V0_ADC: U_ADC (IC1A.B3), U_ADC (IC1B.B3), Power_Supply (7 pins)
P3V0_REF: U_ADC (C14A.2 IC1A.F4 IC1A.G4 IC2A.8), U_ADC (C14B.2 IC1B.F4 IC1B.G4 IC2B.8), Power_Supply (B5.1 C24.2 IC6.6 IC6.7)
P3V3: MODULIQ_ADC_40M_20B_2CH (R52.1 R53.1), SPI_IFC (16 pins)
P3V3_ADC: U_ADC (5 pins), U_ADC (5 pins), Power_Supply (7 pins)
P5V0A: MODULIQ_ADC_40M_20B_2CH (D1.2 D2.2 D3.2 D4.2), U_ADC (C1A.2 IC2A.6 IC2A.7 R2A.2), U_ADC (C1B.2 IC2B.6 IC2B.7 R2B.2), Power_Supply (7 pins)
P12V0: SPI_IFC (6 pins), Power_Supply (8 pins)
CSn0: MODULIQ_ADC_40M_20B_2CH (R53.2), SPI_IFC (IC3.52), U_ADC (IC1B.G1)
CSn0: SPI_IFC (IC3.50), U_ADC (IC1A.G1)
CSn1: MODULIQ_ADC_40M_20B_2CH (R52.2), SPI_IFC (IC3.53), U_ADC (IC1B.A7)
CSn1: SPI_IFC (IC3.51), U_ADC (IC1A.A7)
NetD1_3: MODULIQ_ADC_40M_20B_2CH (D1.3 F1.2), U_ADC (R7A.1)
NetD2_3: MODULIQ_ADC_40M_20B_2CH (D2.3 F2.2), U_ADC (R10A.1)
NetD3_3: MODULIQ_ADC_40M_20B_2CH (D3.3 F3.2), U_ADC (R7B.1)
NetD4_3: MODULIQ_ADC_40M_20B_2CH (D4.3 F4.2), U_ADC (R10B.1)
SCLK: SPI_IFC (IC3.48), U_ADC (IC1A.B7 IC1A.E7), U_ADC (IC1B.B7 IC1B.E7)
SDI: SPI_IFC (IC3.49), U_ADC (IC1A.F7), U_ADC (IC1B.F7)
SDO: SPI_IFC (IC3.44), U_ADC (IC1A.C7)
SDO: SPI_IFC (IC3.45), U_ADC (IC1B.C7)
VDD11: U_ADC (B2B.1 IC1B.A1 IC1B.A2 IC1B.A3), Power_Supply (R38.2)